# EAGLE design Sensor-Board-v001 (EAGLE 6.0)
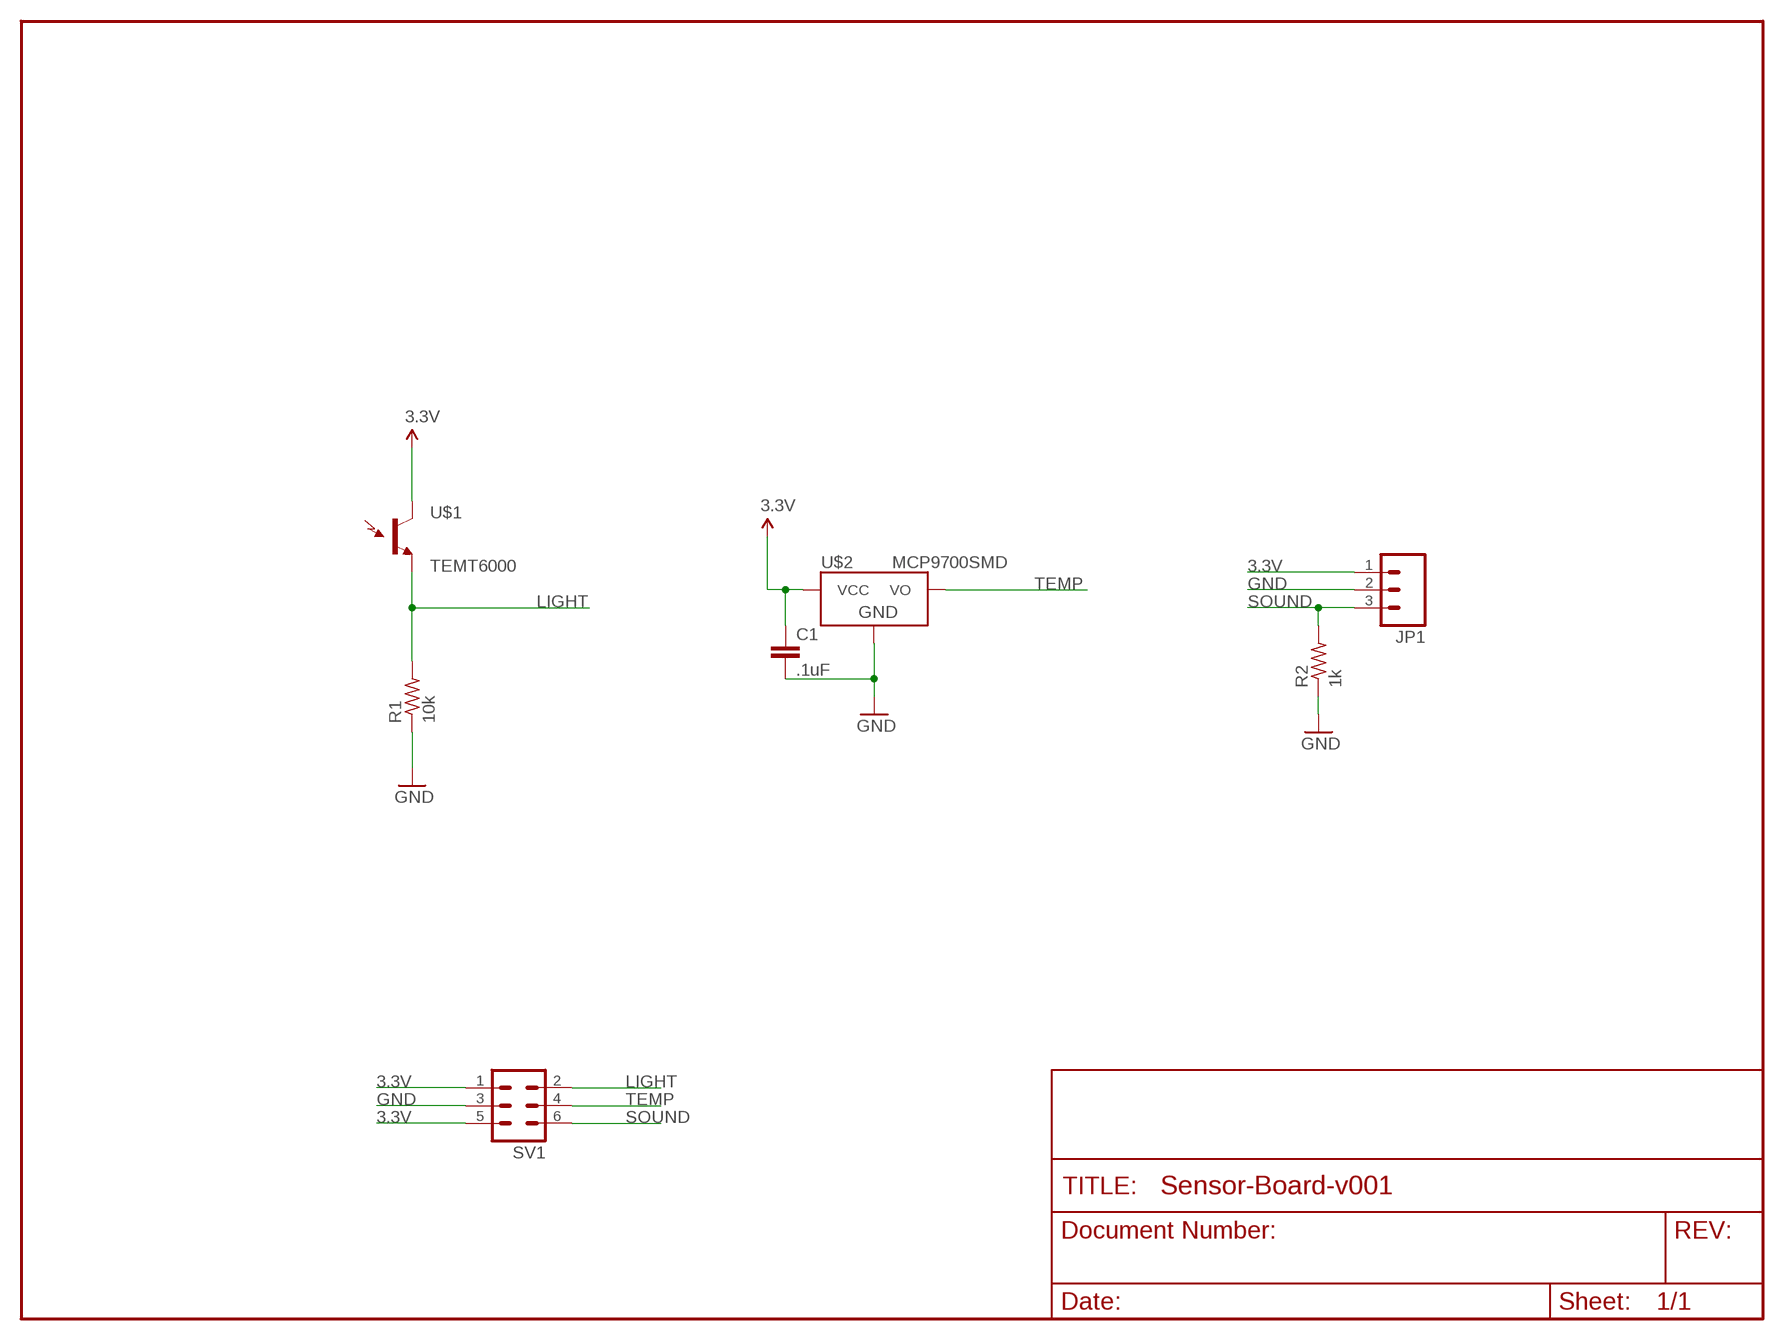
[diagram p0: schematic, sheet 1]

## Parts
C1  .1uF  CAP0603-CAP  [0603-CAP]
JP1  M03PTH  [1X03]
R1  10k  R-US_R0603  [R0603]
R2  1k  R-US_R0603  [R0603]
SV1  ML6  [ML6]
U$1  TEMT6000  [TEMT6000-SEN]
U$2  MCP9700SMD  [SOT23-3]

## Nets
3.3V: C1.1 JP1.1 SV1.1 SV1.5 U$1.COLLECTOR(C1) U$2.1(VCC)
GND: C1.2 JP1.2 R1.1 R2.1 SV1.3 U$2.3(GND)
LIGHT: R1.2 SV1.2 U$1.EMITTER(E1)
SOUND: JP1.3 R2.2 SV1.6
TEMP: SV1.4 U$2.2(VO)

## Library data of the parts
C1 = SparkFun:CAP: Capacitor Standard 0603 ceramic capacitor, and 0.1" leaded capacitor.
JP1 = SparkFun:M03: Header 3 Standard 3-pin 0.1" header. Use with straight break away headers (SKU : PRT-00116), right angle break away headers (PRT-00553), swiss pins (PRT-00743), machine pins (PRT-00117), and female headers (PRT-00115). Molex polarized connector foot print use with SKU : PRT-08232 with associated crimp pins and housings.
R1 R2 = resistor:R-US_: RESISTOR, American symbol
SV1 = con-harting-ml:ML6: HARTING; OC_FARNELL: unknown; OC_NEWARK: unknown
U$1 = SparkFun:TEMT6000: Ambient Light Sensor Simple light detection sensor. Output varies with light intensity input. Spark Fun Electronics SKU : COM-08348
U$2 = SparkFun:MCP9700

## Board
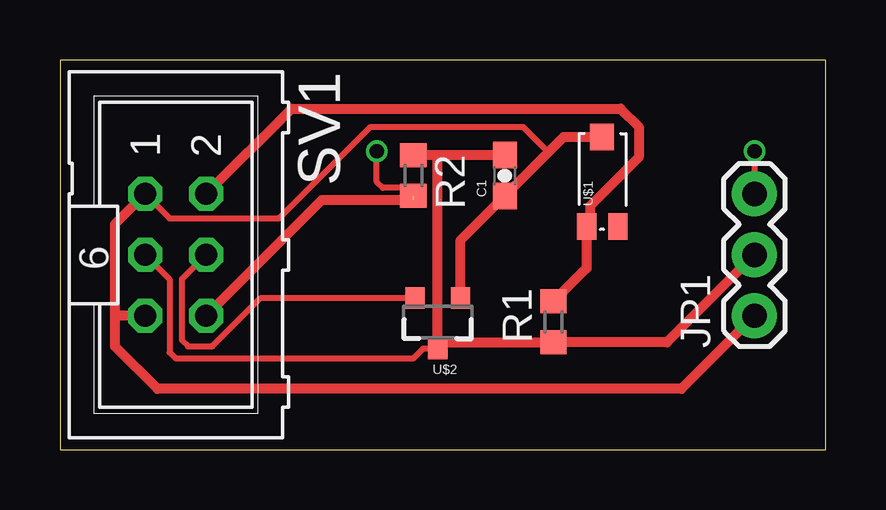
[diagram p1: board, top side]
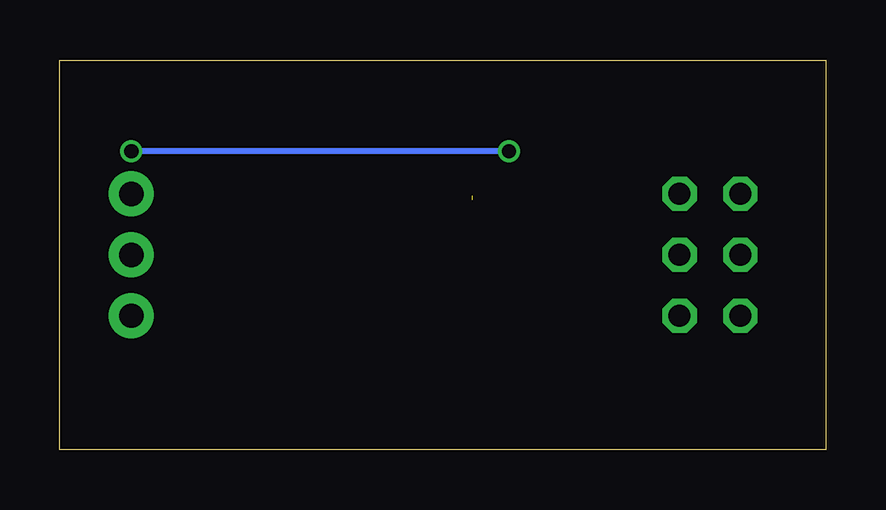
[diagram p2: board, bottom side, seen from below]

Size 31.93 x 16.25 mm. Coordinates in mm from the lower left corner, seen from the top.
Outline: 0,0 31.93,0 31.93,16.25 0,16.25 0,0
Copper layers (1*16): Top 0.035mm / dielectric 1.5mm / Bottom 0.035mm
Design rules: minimum track width 6mil, minimum drill 12mil, track to track 6mil, track to pad 6mil, pad to pad 6mil, via to via 6mil, smd to smd 0mil, copper to edge 10mil, drill to drill 10mil, minimum pad ring 10mil, minimum via ring 6mil, stop-mask expansion 2mil, vias tented up to drill 100mil, thermal gap 10mil

### Footprints (pad centres in the part's own frame; a part is rotated, then mirrored left to right if it is on the bottom)
0603-CAP = smd 1.1 x 1: 1 -0.85,0; 2 0.85,0
1X03 = drill 1.016 pad 1.88: 1 0,0; 2 2.54,0; 3 5.08,0
R0603 = smd 1 x 1.1: 1 -0.85,0; 2 0.85,0
ML6 = drill 0.914 octagon: 1 -2.54,-1.27; 2 -2.54,1.27; 3 0,-1.27; 4 0,1.27; 5 2.54,-1.27; 6 2.54,1.27
TEMT6000-SEN = smd 1.1 x 0.8: BASE -1.87,-0.65; EMITTER -1.87,0.65 | smd 1.1 x 1: COLLECTOR 1.86,0.01
SOT23-3 = smd 0.8 x 0.9: 1 -0.95,-1; 2 0.95,-1; 3 0,1.1

### Placement (x,y rotation side)
C1  18.54,11.43 90 top
JP1  28.96,5.59 90 top
R1  20.57,5.33 90 top
R2  14.73,11.43 270 top
SV1  4.83,8.13 270 top
U$1  22.61,11.18 90 top
U$2  15.75,5.33 180 top

### Tracks (layer width: path | path; a pad name or v marks a point on that pad's centre or on a via)
3.3V
  Top 0.254: SV1.1 4.57,9.65 9.14,9.65 12.95,13.46 19.3,13.46 20.24,12.53 20.49,12.53
  Top 0.406: U$2.1 16.7,8.74 C1.1 20.49,12.53 21,13.04 U$1.COLLECTOR | JP1.1 25.91,2.54 4.06,2.54 2.29,4.32 2.29,5.33 2.29,5.59 | SV1.1 2.29,9.4 2.29,5.59 | SV1.5 2.29,5.59
GND
  Top 0.254: SV1.3 4.57,7.11 4.57,4.06 4.83,3.81 14.73,3.81 15.16,4.23 U$2.3
  Top 0.406: C1.2 15.75,12.28 | 15.75,12.28 R2.1 | 15.75,12.28 U$2.3 16,4.48 R1.1 25.31,4.48 JP1.2
LIGHT
  Top 0.406: R1.2 21.96,7.57 U$1.EMITTER 22.1,9.45 22.1,10.16 24.13,12.19 24.13,13.46 23.37,14.22 9.65,14.22 SV1.2
SOUND  (via drill 0.6)  (1 unrouted)
  Top 0.254: v28.96,12.45 JP1.3 | v13.21,12.45 13.21,11.18 13.46,10.92 14.73,10.92 R2.2
  Top 0.406: SV1.6 10.92,10.41 14.73,10.41
  Bottom 0.254: v13.21,12.45 v28.96,12.45
TEMP
  Top 0.254: SV1.4 5.08,7.11 5.08,4.57 5.33,4.32 6.35,4.32 8.37,6.33 U$2.2

### Text on the board
tDocu: AUD | GND | VCC